# Altium schematic sheet 运放原理图.SchDoc
size A3
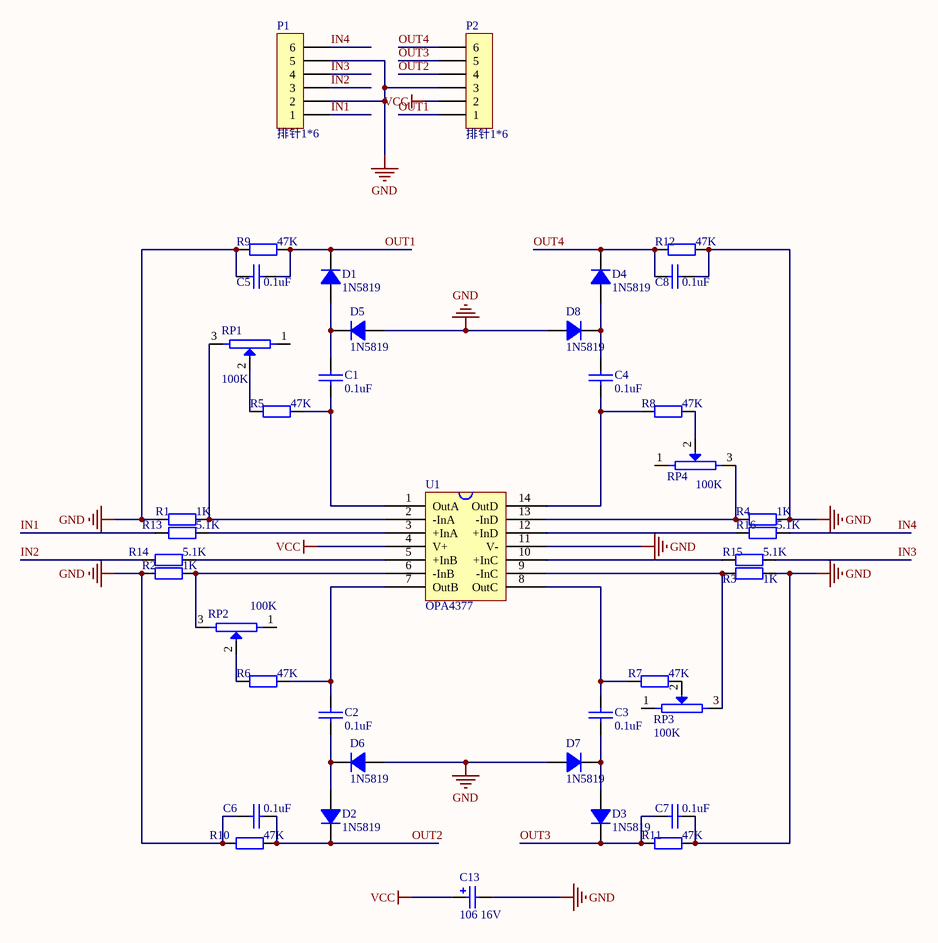
[diagram p0: 运放原理图.SchDoc]

## Parts
C1  0.1uF  [C0805]
C2  0.1uF  [C0805]
C3  0.1uF  [C0805]
C4  0.1uF  [C0805]
C5  0.1uF  [C0805]
C6  0.1uF  [C0805]
C7  0.1uF  [C0805]
C8  0.1uF  [C0805]
C13  106 16V  [Tan-A3216]
D1  1N5819  [SOD-123]
D2  1N5819  [SOD-123]
D3  1N5819  [SOD-123]
D4  1N5819  [SOD-123]
D5  1N5819  [SOD-123]
D6  1N5819  [SOD-123]
D7  1N5819  [SOD-123]
D8  1N5819  [SOD-123]
P1  排针1*6  [LQ_SIP6]
P2  排针1*6  [LQ_SIP6]
R1  1k  [R0805]
R2  1k  [R0805]
R3  1k  [R0805]
R4  1k  [R0805]
R5  47k  [R0805]
R6  47k  [R0805]
R7  47k  [R0805]
R8  47k  [R0805]
R9  47k  [R0805]
R10  47k  [R0805]
R11  47k  [R0805]
R12  47k  [R0805]
R13  5.1k  [R0805]
R14  5.1k  [R0805]
R15  5.1k  [R0805]
R16  5.1k  [R0805]
RP1  100K  [电位器]
RP2  100K  [电位器]
RP3  100K  [电位器]
RP4  100K  [电位器]
U1  OPA4377  [TSSOP14]

## Nets
GND: C5.1 C6.2 C7.1 C8.2 C13.2 D5.A D6.A D7.A D8.A P1.2 P1.5 P2.3 R1.1 R2.1 R3.2 R4.2 R9.1 R10.1 R11.2 R12.2 U1.11(V-)
VCC: C13.1 P2.2 U1.4(V+)
IN1: P1.1 R13.1
IN2: P1.3 R14.1
IN3: P1.4 R15.2
IN4: P1.6 R16.2
OUT1: C5.2 D1.K P2.1 R9.2
OUT2: C6.1 D2.K P2.4 R10.2
OUT3: C7.2 D3.K P2.5 R11.1
OUT4: C8.1 D4.K P2.6 R12.1
NetC1_1: C1.1 R5.2 U1.1(OutA)
NetC1_2: C1.2 D1.A D5.K
NetC2_1: C2.1 R6.2 U1.7(OutB)
NetC2_2: C2.2 D2.A D6.K
NetC3_1: C3.1 R7.1 U1.8(OutC)
NetC3_2: C3.2 D3.A D7.K
NetC4_1: C4.1 R8.1 U1.14(OutD)
NetC4_2: C4.2 D4.A D8.K
NetR1_2: R1.2 RP1.3 U1.2(-InA)
NetR2_2: R2.2 RP2.3 U1.6(-InB)
NetR3_1: R3.1 RP3.3 U1.9(-InC)
NetR4_1: R4.1 RP4.3 U1.13(-InD)
NetR5_1: R5.1 RP1.2
NetR6_1: R6.1 RP2.2
NetR7_2: R7.2 RP3.2
NetR8_2: R8.2 RP4.2
NetR13_2: R13.2 U1.3(+InA)
NetR14_2: R14.2 U1.5(+InB)
NetR15_1: R15.1 U1.10(+InC)
NetR16_1: R16.1 U1.12(+InD)

Not connected (* = marked no-connect by the designer): RP1 1; RP2 1; RP3 1; RP4 1

## Notes on the sheet
- Title
- Size:
- Date:
- A3
- Number:
- Time:
- Revision:
- Sheet
- of
- File:

## Library data of the parts
C1-C8 = 普通电容: Capacitor
C13 = 钽电容
D1-D8 = 1N5819: 1N5819 二极管 Diode; Imax: 500mA; Published: 8-Jun-2000; Revision: July-2002: Re-released for DXP Platform.; Publisher: Altium Limited; Price(RMB): 0.000
P1 P2 = CON6: Connector
R1-R16 = Res2: Resistor; Published: 8-Jun-2000; LatestRevisionDate: 17-Jul-2002; LatestRevisionNote: Re-released for DXP Platform.; PackageReference: AXIAL-0.4; Publisher: Altium Limited; PackageDescription: Axial Device, Thru-Hole; 2 Leads; 0.4 in Pin Spacing
  R1-R4: Value: 1K
  R5-R12: Value: 47K
  R13-R16: Value: 5.1K
RP1-RP4 = VR: 3端可调电阻
U1 = OPA4377: OPA4377 四路轨对轨运放